# Altium project TriMod Adapter CPLD Version.PrjPcb
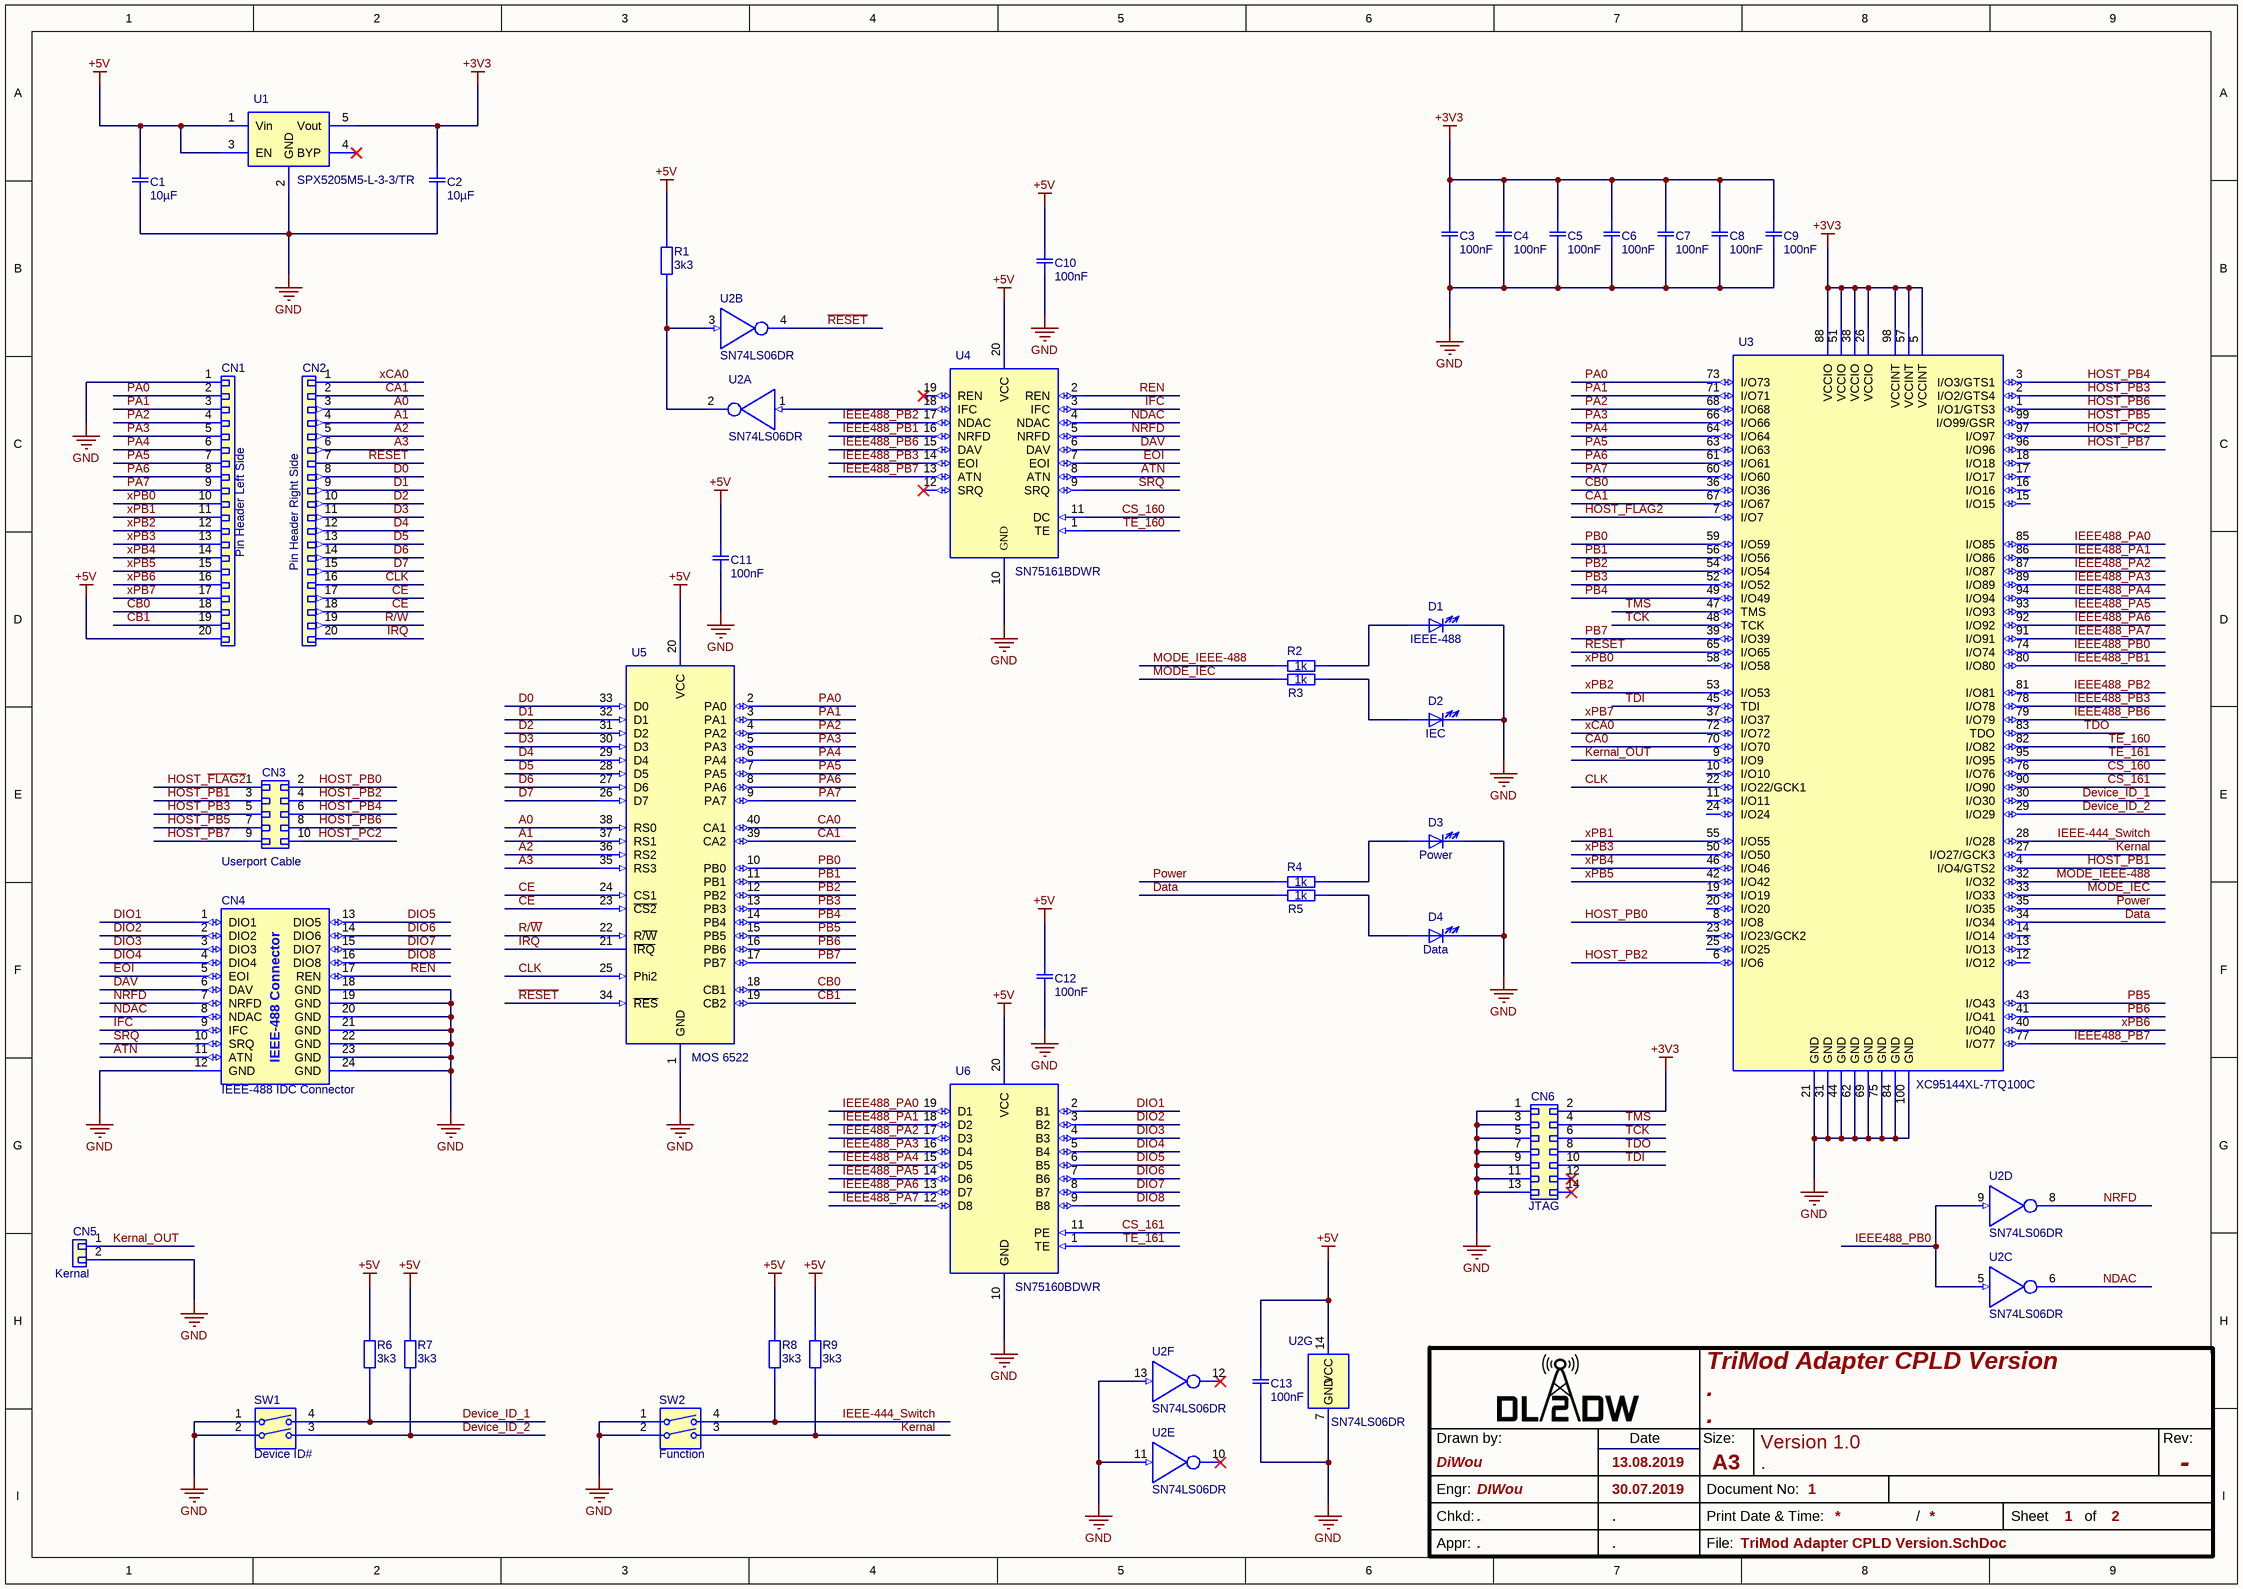
[diagram p0: TriMod Adapter CPLD Version.SchDoc]
Version: 1.0; Title: Projektname; Revision: -; Author: PCB-Tech
1 sheet, 40 parts. Net scope: global (net labels, ports and power ports of the same name join across sheets).
Board file: TriMod Adapter CPLD Version.PcbDoc

## Sheet TriMod Adapter CPLD Version.SchDoc: Projektname
size 420 x 297 mm; ApprovedBy: .; CheckedBy: .; Author: DiWou; CompanyName: DL2DW; DrawnBy: DiWou; Engineer: DIWou; Organization: DL2DW; DocumentNumber: 1; Revision: -; SheetNumber: 1; SheetTotal: 2; DrawnDate: 13.08.2019; EngrDate: 30.07.2019; ChkdDate: .; Title1: TriMod Adapter CPLD Version; Title2: .; Title3: .; Desc1: Version 1.0; Desc2: .; ApprDate: .

### Parts
C1  10µF  [Kemet C0805CxxxK8RACTU Series H=1.4mm]
C2  10µF  [Kemet C0805CxxxK8RACTU Series H=1.4mm]
C3  100nF  [CAP 100nF SMD 0603 C0603C104J3RACTU]
C4  100nF  [CAP 100nF SMD 0603 C0603C104J3RACTU]
C5  100nF  [CAP 100nF SMD 0603 C0603C104J3RACTU]
C6  100nF  [CAP 100nF SMD 0603 C0603C104J3RACTU]
C7  100nF  [CAP 100nF SMD 0603 C0603C104J3RACTU]
C8  100nF  [CAP 100nF SMD 0603 C0603C104J3RACTU]
C9  100nF  [CAP 100nF SMD 0603 C0603C104J3RACTU]
C10  100nF  [CAP 100nF SMD 0603 C0603C104J3RACTU]
C11  100nF  [CAP 100nF SMD 0603 C0603C104J3RACTU]
C12  100nF  [CAP 100nF SMD 0603 C0603C104J3RACTU]
C13  100nF  [CAP 100nF SMD 0603 C0603C104J3RACTU]
CN1  Pin Header Left Side  [Pin Header 01x20 2.54mm Horizontal Male]
CN2  Pin Header Right Side  [Pin Header 01x20 2.54mm Horizontal Male]
CN3  Userport Cable  [IDC Header 2x5 P2.54mm Right Angle]
CN4  IEEE-488 IDC Connector  [IEEE-488 IDC Header 2x12 P2.54mm Right Angle]
CN5  Kernal  [Pin Header 01x02 Right Angle RM2.54mm L5.08mm]
CN6  JTAG  [IDC Header 2x7 P2.54mm Straight]
D1  IEEE-488  [LED Blue SMD 0603]
D2  IEC  [LED Green SMD 0603]
D3  Power  [LED Red SMD 0603]
D4  Data  [LED Yellow SMD 0603]
R1  3k3  [3,3 kOhm R 0805 SMD]
R2  1k  [1,0 kOhm R 0805 SMD]
R3  1k  [1,0 kOhm R 0805 SMD]
R4  1k  [1,0 kOhm R 0805 SMD]
R5  1k  [1,0 kOhm R 0805 SMD]
R6  3k3  [3,3 kOhm R 0805 SMD]
R7  3k3  [3,3 kOhm R 0805 SMD]
R8  3k3  [3,3 kOhm R 0805 SMD]
R9  3k3  [3,3 kOhm R 0805 SMD]
SW1  Device ID#  [DIP Switch x02]
SW2  Function  [DIP Switch x02]
U1  SPX5205M5-L-3-3/TR  [SOT-23-5]
U2  SN74LS06DR  [SN74LS06DR SOIC-14 P1.27mm W3.9mm]  (parts A,B,C,D,E,F,G of 7)
U3  XC95144XL-7TQ100C  [TQFP-100 P0.5mm XC95144XL-7TQ100C]
U4  SN75161BDWR  [SN75161BDWR SOIC-20 W7.5mm P1,27mm]
U5  MOS 6522  [MOS 6522 with Socket]
U6  SN75160BDWR  [SN75160BDWR SOIC-20 W7.5mm P1,27mm]

### Nets
+3V3: C2.2 C3.2 C4.2 C5.2 C6.2 C7.2 C8.2 C9.2 CN6.2 U1.5(Vout) U3.5(VCCINT) U3.26(VCCIO) U3.38(VCCIO) U3.51(VCCIO) U3.57(VCCINT) U3.88(VCCIO) U3.98(VCCINT)
+5V: C1.2 C10.2 C11.2 C12.2 C13.2 CN1.20 R1.2 R6.2 R7.2 R8.2 R9.2 U1.1(Vin) U1.3(EN) U2.14(VCC) U4.20(VCC) U5.20(VCC) U6.20(VCC)
GND: C1.1 C2.1 C3.1 C4.1 C5.1 C6.1 C7.1 C8.1 C9.1 C10.1 C11.1 C12.1 C13.1 CN1.1 CN4.12(GND) CN4.18(GND) CN4.19(GND) CN4.20(GND) CN4.21(GND) CN4.22(GND) CN4.23(GND) CN4.24(GND) CN5.2 CN6.1 CN6.3 CN6.5 CN6.7 CN6.9 CN6.11 CN6.13 D1.1 D2.1 D3.1 D4.1 SW1.1 SW1.2 SW2.1 SW2.2 U1.2(GND) U2.7(GND) U2.11(5A) U2.13(6A) U3.21(GND) U3.31(GND) U3.44(GND) U3.62(GND) U3.69(GND) U3.75(GND) U3.84(GND) U3.100(GND) U4.10(GND) U5.1(GND) U6.10(GND)
A0: CN2.3 U5.38(RS0)
A1: CN2.4 U5.37(RS1)
A2: CN2.5 U5.36(RS2)
A3: CN2.6 U5.35(RS3)
ATN: CN4.11(ATN) U4.8(ATN)
~{CE}: CN2.18 U5.23(~{CS2})
CA0: U3.70(I/O70) U5.40(CA1)
CA1: CN2.2 U3.67(I/O67) U5.39(CA2)
CB0: CN1.18 U3.36(I/O36) U5.18(CB1)
CB1: CN1.19 U5.19(CB2)
CE: CN2.17 U5.24(CS1)
CLK: CN2.16 U3.22(I/O22/GCK1) U5.25(Phi2)
CS_160: U3.76(I/O76) U4.11(DC)
CS_161: U3.90(I/O90) U6.11(PE)
D0: CN2.8 U5.33(D0)
D1: CN2.9 U5.32(D1)
D2: CN2.10 U5.31(D2)
D3: CN2.11 U5.30(D3)
D4: CN2.12 U5.29(D4)
D5: CN2.13 U5.28(D5)
D6: CN2.14 U5.27(D6)
D7: CN2.15 U5.26(D7)
Data: R5.1 U3.34(I/O34)
DAV: CN4.6(DAV) U4.6(DAV)
Device_ID_1: R6.1 SW1.4 U3.30(I/O30)
Device_ID_2: R7.1 SW1.3 U3.29(I/O29)
DIO1: CN4.1(DIO1) U6.2(B1)
DIO2: CN4.2(DIO2) U6.3(B2)
DIO3: CN4.3(DIO3) U6.4(B3)
DIO4: CN4.4(DIO4) U6.5(B4)
DIO5: CN4.13(DIO5) U6.6(B5)
DIO6: CN4.14(DIO6) U6.7(B6)
DIO7: CN4.15(DIO7) U6.8(B7)
DIO8: CN4.16(DIO8) U6.9(B8)
EOI: CN4.5(EOI) U4.7(EOI)
HOST_~{FLAG2}: CN3.1 U3.7(I/O7)
HOST_~{PC2}: CN3.10 U3.97(I/O97)
HOST_PB0: CN3.2 U3.8(I/O8)
HOST_PB1: CN3.3 U3.4(I/O4/GTS2)
HOST_PB2: CN3.4 U3.6(I/O6)
HOST_PB3: CN3.5 U3.2(I/O2/GTS4)
HOST_PB4: CN3.6 U3.3(I/O3/GTS1)
HOST_PB5: CN3.7 U3.99(I/O99/GSR)
HOST_PB6: CN3.8 U3.1(I/O1/GTS3)
HOST_PB7: CN3.9 U3.96(I/O96)
~{IRQ}: CN2.20 U5.21(~{IRQ})
IEEE488_PA0: U3.85(I/O85) U6.19(D1)
IEEE488_PA1: U3.86(I/O86) U6.18(D2)
IEEE488_PA2: U3.87(I/O87) U6.17(D3)
IEEE488_PA3: U3.89(I/O89) U6.16(D4)
IEEE488_PA4: U3.94(I/O94) U6.15(D5)
IEEE488_PA5: U3.93(I/O93) U6.14(D6)
IEEE488_PA6: U3.92(I/O92) U6.13(D7)
IEEE488_PA7: U3.91(I/O91) U6.12(D8)
IEEE488_PB0: U2.5(3A) U2.9(4A) U3.74(I/O74)
IEEE488_PB1: U3.80(I/O80) U4.16(NRFD)
IEEE488_PB2: U3.81(I/O81) U4.17(NDAC)
IEEE488_PB3: U3.78(I/O78) U4.14(EOI)
IEEE488_PB6: U3.79(I/O79) U4.15(DAV)
IEEE488_PB7: U3.77(I/O77) U4.13(ATN)
IEEE-444_Switch: R8.1 SW2.4 U3.28(I/O28)
IFC: CN4.9(IFC) U4.3(IFC)
Kernal: R9.1 SW2.3 U3.27(I/O27/GCK3)
Kernal_OUT: CN5.1 U3.9(I/O9)
MODE_IEC: R3.1 U3.33(I/O33)
MODE_IEEE-488: R2.1 U3.32(I/O32)
NDAC: CN4.8(NDAC) U2.6(3Y) U4.4(NDAC)
NRFD: CN4.7(NRFD) U2.8(4Y) U4.5(NRFD)
PA0: CN1.2 U3.73(I/O73) U5.2(PA0)
PA1: CN1.3 U3.71(I/O71) U5.3(PA1)
PA2: CN1.4 U3.68(I/O68) U5.4(PA2)
PA3: CN1.5 U3.66(I/O66) U5.5(PA3)
PA4: CN1.6 U3.64(I/O64) U5.6(PA4)
PA5: CN1.7 U3.63(I/O63) U5.7(PA5)
PA6: CN1.8 U3.61(I/O61) U5.8(PA6)
PA7: CN1.9 U3.60(I/O60) U5.9(PA7)
PB0: U3.59(I/O59) U5.10(PB0)
PB1: U3.56(I/O56) U5.11(PB1)
PB2: U3.54(I/O54) U5.12(PB2)
PB3: U3.52(I/O52) U5.13(PB3)
PB4: U3.49(I/O49) U5.14(PB4)
PB5: U3.43(I/O43) U5.15(PB5)
PB6: U3.41(I/O41) U5.16(PB6)
PB7: U3.39(I/O39) U5.17(PB7)
Power: R4.1 U3.35(I/O35)
R/~{W}: CN2.19 U5.22(R~{/W})
~{RESET}: CN2.7 U2.4(2Y) U3.65(I/O65) U5.34(~{RES})
REN: CN4.17(REN) U4.2(REN)
SRQ: CN4.10(SRQ) U4.9(SRQ)
TCK: CN6.6 U3.48(TCK)
TDI: CN6.10 U3.45(TDI)
TDO: CN6.8 U3.83(TDO)
TE_160: U3.82(I/O82) U4.1(TE)
TE_161: U3.95(I/O95) U6.1(TE)
TMS: CN6.4 U3.47(TMS)
xCA0: CN2.1 U3.72(I/O72)
xPB0: CN1.10 U3.58(I/O58)
xPB1: CN1.11 U3.55(I/O55)
xPB2: CN1.12 U3.53(I/O53)
xPB3: CN1.13 U3.50(I/O50)
xPB4: CN1.14 U3.46(I/O46)
xPB5: CN1.15 U3.42(I/O42)
xPB6: CN1.16 U3.40(I/O40)
xPB7: CN1.17 U3.37(I/O37)
NetD1_2: D1.2 R2.2
NetD2_2: D2.2 R3.2
NetD3_2: D3.2 R4.2
NetD4_2: D4.2 R5.2
NetR1_1: R1.1 U2.2(1Y) U2.3(2A)
NetU2_1: U2.1(1A) U4.18(IFC)

Not connected (* = marked no-connect by the designer): CN6 12* 14*; U1 4(BYP)*; U2 10(5Y)* 12(6Y)*; U3 10(I/O10) 11(I/O11) 12(I/O12) 13(I/O13) 14(I/O14) 15(I/O15) 16(I/O16) 17(I/O17) 18(I/O18) 19(I/O19) 20(I/O20) 23(I/O23/GCK2) 24(I/O24) 25(I/O25); U4 12(SRQ)* 19(REN)*

### Notes on the sheet
- Drawn by:
- Date
- Size:
- A3
- Rev:
- Engr:
- Chkd:
- Appr:
- File:
- Document No:
- Print Date & Time:
- /
- Sheet
- of

### Library data of the parts
C1 C2 = CMP-Capacitors-Ceramic_Capacitors-00016-2: KEMET - C0805C106K8RACTU - CAP, 10µF, 10V, 10%, X7R, 0805; Dissipation Factor: 7.5%; Capacitance: 10uF; Max Operating Temperature: 125°C; Packaging: Tape and Reel; Case Code (Imperial): 0805; Depth: 1.25mm; Dielectric Material: Ceramic; Voltage: 10V; Voltage Rating (DC): 10V; Mount: Surface Mount,PCB; Min Operating Temperature: -55°C; Case Code (Metric): 2012; Case/Package: 0805; Thickness: 0.055inch; Termination: SMD/SMT; Voltage Rating: 10V; Height: 1.25mm; Dielectric: X7R; Width: 1.2mm; Package Quantity: 1; Length: 2mm; REACH SVHC: No SVHC; Tolerance: 10%
C3-C13 = CMP-Capacitors-Ceramic_Capacitors-00012-1: KEMET         C0603C104J3RACTU             SMD Multilayer Ceramic Capacitor, 0603 [1608 Metric], 0.1 F, 25 V,  5%, X7R, C Series; Voltage Rating (DC): 25V; Height: 0.8mm; Dielectric: X7R; Case Code (Metric): 1608; Width: 0.031inch; Depth: 0.8mm; Min Operating Temperature: -55°C; Number of Pins: 2; Mount: Surface Mount,PCB; REACH SVHC: No SVHC; Packaging: Tape and Reel; Case Code (Imperial): 0603; Contact Plating: Tin,Matte; Length: 1.6mm; Case/Package: 0603; Lead Pitch: 0.7mm; Package Quantity: 4000; Tolerance: 5%; Radiation Hardening: No; Dielectric Material: Ceramic; Voltage: 25V; Termination: SMD/SMT; Capacitance: 100nF; Voltage Rating: 25V; Thickness: 0.034inch; Max Operating Temperature: 125°C
CN1 CN2 = CMP-Connectors-Male_PIN_Headers-00019-5: CONN HEADER .100 SNGL STR 20POS; Number of Positions: 20; Connector Type: Male Pin; Pitch: 0.1inch; Packaging: Bulk; Color: Black; Termination: Solder; Contact Plating: Gold; Number of Rows: 1; Contact Mating Length: 0.318inch; Package Quantity: 1; Mount: Through Hole
CN3 = CMP-Connectors-IDC_Connectors-00002-2: Conn Shrouded Header HDR 10 POS 2.54mm Solder RA Thru-Hole Tube; Gender: Male; Number of Contacts: 10; Max Current Rating: 2.5A; Contact Material: Bronze,Copper Alloy; Max Operating Temperature: 125°C; Pitch: 2.54mm; Contact Plating: Gold; Housing Material: Polyester; Length: 91.4mm; Orientation: Right Angle; Depth: 12.64mm; Height: 8.51mm; Termination: Solder; Housing Color: Black; Min Operating Temperature: -40°C; Radiation Hardening: No; Packaging: Bulk; REACH SVHC: No SVHC; Number of Rows: 2; Mount: Through Hole
CN4 = CMP-Commodore-00004-3: IEEE-488 IDC Connector Right Angle or Straight
CN5 = CMP-Connectors-Male_PIN_Headers-00021-2: CONN HEADER R/A 2POS 2.54MM; Pitch: 0.1inch; Number of Positions: 2; Connector Type: Male Pin; Contact Mating Length: 0.23inch; Number of Rows: 1; Contact Plating: Gold; Termination: Solder; Package Quantity: 1; Mount: Through Hole; Color: Black; Packaging: Bulk
CN6 = CMP-Connectors-IDC_Connectors-00028-1: Conn Shrouded Header HDR 14 POS 2.54mm Solder ST Thru-Hole; Row Spacing: 0.1inch; Connector Type: Male Pin; Number of Positions: 14; Gender: Male; REACH SVHC: No SVHC; Package Quantity: 1; Contact Material: Bronze; Packaging: Bulk; Length: 21.59mm; Max Operating Temperature: 125°C; Orientation: Straight; Min Operating Temperature: -55°C; Depth: 9.27mm; Contact Mating Length: 0.25inch; Color: Black; Pitch: 2.54mm; Contact Plating: Gold; Termination: Solder; Mount: Through Hole; Number of Contacts: 14; Housing Material: Polyester; Radiation Hardening: No; Number of Rows: 2; Housing Color: Black
D1 = CMP-LEDs-00001-1: LED BLUE DIFFUSED 0603 SMD; Lens Style: Flat; Lens Size: 0.8mm; Viewing Angle: 140°; Test Current: 20mA; Dominant Wavelength: 470nm; Forward Voltage: 3.2V; Luminous Intensity: 80mcd; Case/Package: 0603; Length: 1.6mm; Lens Transparency: Diffused; Height: 0.5mm; Color: Blue; Mount: Surface Mount; Width: 0.8mm; Packaging: Tape and Reel
D2 = CMP-LEDs-00004-2: LED BLUE DIFFUSED 0603 SMD; Dominant Wavelength: 470nm; Test Current: 20mA; Lens Style: Flat; Viewing Angle: 140°; Forward Voltage: 3.2V; Lens Size: 0.8mm; Luminous Intensity: 80mcd; Color: Blue; Case/Package: 0603; Mount: Surface Mount; Width: 0.8mm; Lens Transparency: Diffused; Length: 1.6mm; Height: 0.5mm; Packaging: Tape and Reel
D3 = CMP-LEDs-00005-1: LED RED DIFFUSED 0603 SMD; Viewing Angle: 140°; Dominant Wavelength: 630nm; Luminous Intensity: 70mcd; Forward Voltage: 2V; Test Current: 20mA; Lens Style: Flat; Lens Size: 0.8mm; Lens Transparency: Diffused; Packaging: Tape and Reel; Case/Package: 0603; Case Code (Imperial): 0603; Width: 0.8mm; Length: 1.6mm; Height: 0.5mm; Case Code (Metric): 1608; Color: Red; Mount: Surface Mount
D4 = CMP-LEDs-00003-2: LED YELLOW DIFFUSED 0603 SMD; Test Current: 20mA; Forward Voltage: 2V; Luminous Intensity: 100mcd; Lens Style: Flat; Dominant Wavelength: 589nm; Viewing Angle: 140°; Lens Size: 0.8mm; Length: 1.6mm; Mount: Surface Mount; Packaging: Cut Tape; Lens Transparency: Diffused; Case/Package: 0603; Color: Yellow; Case Code (Metric): 1608; Case Code (Imperial): 0603; Height: 0.5mm; Width: 0.8mm
R1 R6-R9 = CMP-Resistors-Yageo_SMD_0805-0084-1: RES SMD 3.3K OHM 1% 1/8W 0805; Resistance: 3.3kR; Max Power Dissipation: 125mW; Voltage Rating: 150V; Temperature Coefficient: 100ppm/°C; Number of Terminations: 2; Termination: SMD/SMT; Case Code (Metric): 2012; Height: 0.5mm; Case Code (Imperial): 0805; Package Quantity: 1; Features: Moisture Resistant; Width: 0.049inch; Max Operating Temperature: 155°C; Depth: 1.25mm; Power Rating: 125mW; Length: 2mm; Lead Free: Lead Free; Tolerance: 1%; Composition: Thick Film; Weight: 0.000194oz; REACH SVHC: No SVHC; Packaging: Tape and Reel; Min Operating Temperature: -55°C; Case/Package: 0805
R2-R5 = CMP-Resistors-Yageo_SMD_0805-0072-1: RES SMD 1K OHM 1% 1/8W 0805; Voltage Rating: 150V; Temperature Coefficient: 100ppm/°C; Resistance: 1kR; Max Power Dissipation: 125mW; Height: 0.024inch; Number of Pins: 2; Width: 0.049inch; Min Operating Temperature: -55°C; Termination: SMD/SMT; REACH SVHC: Unknown; Lead Free: Lead Free; Package Quantity: 1; Number of Terminations: 2; Features: Moisture Resistant; Packaging: Tape and Reel; Case Code (Imperial): 0805; Voltage Rating (DC): 150V; Military Standard: Not; Case Code (Metric): 2012; Case/Package: 0805; Tolerance: 1%; Length: 0.079inch; Power Rating: 125mW; Composition: Thick Film; Depth: 1.25mm; Max Operating Temperature: 155°C
SW1 SW2 = CMP-Switches-0001-4: SWITCH SLIDE DIP SPST 25MA 24V; Actuator Type: Slide (Standard); Number of Positions: 2; Electrical Life: 2000Cycles; Pitch: 0.1inch; Body Material: Nylon,Polyamide; Mechanical Life: 5000Cycles; Washable: No; Throw Configuration: SPST; Min Operating Temperature: -40°C; Max Operating Temperature: 85°C; Length: 0.239inch; Package Quantity: 85; Packaging: Rail/Tube; Contact Plating: Gold; Mount: Through Hole; Voltage Rating (DC): 24V; Termination: PC Pin; Current Rating: 25mA
U1 = CMP-ICs-Power_Supply-00002-2: LDO Regulator Pos 3.3V 0.15A 5-Pin SOT-23 T/R; Min Input Voltage: 2.5V; Number of Outputs: 1; Dropout Voltage: 210mV; Accuracy: 1%; Polarity: Positive; Max Input Voltage: 16V; Output Type: Fixed; Output Current: 150mA; Quiescent Current: 1uA; Packaging: Tape and Reel; Lead Free: Lead Free; Case/Package: SOT-23; Height: 1.15mm; Number of Regulators: 1; Max Operating Temperature: 125°C; Min Operating Temperature: -40°C; Output Voltage: 3.3V; Width: 1.6mm; Radiation Hardening: No; Mount: Surface Mount; Length: 2.9mm; Max Output Current: 150mA; Min Output Voltage: 3.3V; Number of Pins: 5
U2 = CMP-ICs-74xx-series-00051-2: IC INVERTER OPEN COL 6CH 14SOIC; Propagation Delay: 20ns; High Level Output Current: -250uA; Logic Function: Buffer,Inverter; Polarity: Inverting; Max Supply Voltage: 5.25V; Number of Inputs: 6; Operating Supply Voltage: 5V; Min Supply Voltage: 4.75V; Low Level Output Current: 40mA; Lead Free: Lead Free; Radiation Hardening: No; Package Quantity: 1; Max Operating Temperature: 70°C; REACH SVHC: No SVHC; Turn-On Delay Time: 20ns; Mount: Surface Mount; Number of Pins: 14; Number of Elements: 6; Packaging: Tape and Reel; Number of Outputs: 6; Number of Bits: 6; Number of Input Lines: 6; Min Operating Temperature: 0°C; Number of Channels: 6; Case/Package: SOIC; Number of Gates: 6; Contact Plating: Gold; Number of Circuits: 6; Number of Output Lines: 6
U3 = CMP-ICs-CPLD_FPGA-00000-1: IC CPLD 144MC 7.5NS 100TQFP; Speed Grade: 7; Operating Supply Voltage: 3.3V; Max Supply Voltage: 3.6V; Number of Gates: 3200; Min Supply Voltage: 3V; Number of I/Os: 81; Number of Macrocells: 144; Number of Logic Blocks (LABs): 8; Max Frequency: 125MHz; Memory Type: FLASH; Turn-On Delay Time: 7.5ns; Mount: Surface Mount; Number of Pins: 100; Propagation Delay: 7.5ns; Package Quantity: 90; Case/Package: LQFP; Contact Plating: Tin,Lead; Packaging: Tray; Lead Free: Contains Lead; Min Operating Temperature: 0°C; Number of Logic Elements/Cells: 8; Max Operating Temperature: 70°C
U4 = CMP-ICs-Specials-00022-2: TEXAS INSTRUMENTS         SN75161BDWR; Number of Transceivers: 1; Number of Transmitters: 8; Propagation Delay: 22ns; Logic Function: Transceiver; Operating Supply Voltage: 5V; Low Level Output Current: 48mA; Min Supply Voltage: 4.75V; Max Supply Voltage: 5.25V; High Level Output Current: -5.2mA; Nominal Supply Current: 110mA; Package Quantity: 1; Packaging: Tape and Reel; REACH SVHC: No SVHC; Number of Drivers: 8; Number of Channels: 8; Lead Free: Lead Free; Max Operating Temperature: 70°C; Mount: Surface Mount; Number of Pins: 20; Case/Package: SOIC; Weight: 0.018953oz; Output Current: 48mA; Number of Receivers: 8; Operating Supply Current: 110mA; Min Operating Temperature: 0°C; Radiation Hardening: No
U5 = CMP-ICs-Specials-00001-3: I/O Controller Interface IC Versatile Interface Adapter; Operating Supply Voltage: 5V; Interface: Serial; Operating Supply Current: 500uA; Data Bus Width: 8b; Min Operating Temperature: -40°C; Packaging: Rail/Tube; Case/Package: PDIP; Max Operating Temperature: 85°C; Weight: 0.210004oz
U6 = CMP-ICs-Specials-00023-1: TEXAS INSTRUMENTS         SN75160BDWR.            GENERAL-PURPOSE INTERFACE BUS  ((NW)); Propagation Delay: 22ns; Number of Drivers: 8; Max Supply Current: 110mA; Operating Supply Voltage: 5V; High Level Output Current: -5.2mA; ESD Protection: No; Max Supply Voltage: 5.25V; Output Current: 48mA; Min Supply Voltage: 4.75V; Number of Transceivers: 1; Logic Function: Transceiver; Min Operating Temperature: 0°C; Radiation Hardening: No; Lead Free: Lead Free; Package Quantity: 1; Case/Package: SOIC; Number of Transmitters: 8; Contact Plating: Gold; Weight: 0.018953oz; Number of Channels: 8; Max Operating Temperature: 70°C; REACH SVHC: No SVHC; Number of Receivers: 8; Packaging: Tape and Reel; Low Level Output Current: 48mA; Number of Pins: 20; Nominal Supply Current: 110mA; Mount: Surface Mount